# EAGLE design avoccado-avr-pcb-yolandi (EAGLE 7.2.0)
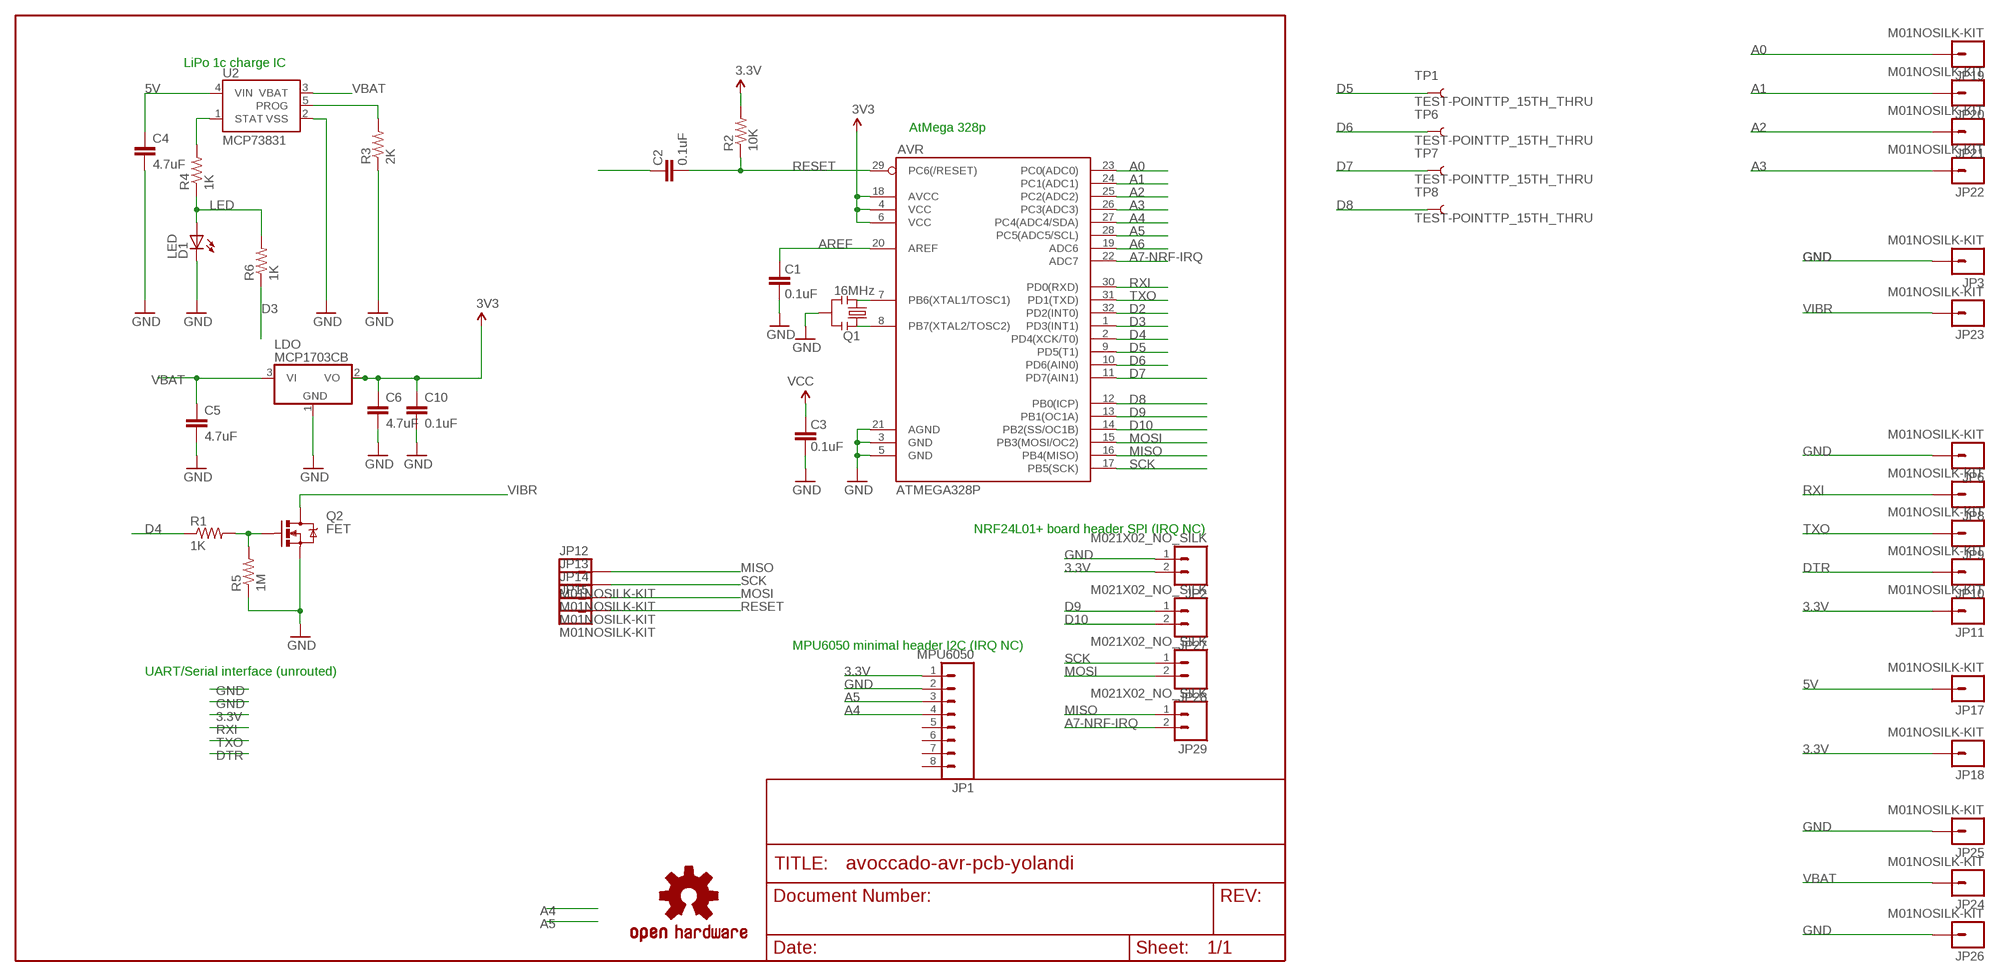
[diagram p0: schematic, sheet 1]

## Parts
AVR  ATMEGA328P  ATMEGA328_SMT  [TQFP32-08]
C1  0.1uF  CAP0402  [C0402]
C2  0.1uF  CAP0402  [C0402]
C3  0.1uF  CAP0402  [C0402]
C4  4.7uF  4.7UF-6.3V-10%(0603)0603  [0603-CAP]
C5  4.7uF  4.7UF-6.3V-10%(0603)0603  [0603-CAP]
C6  4.7uF  4.7UF-6.3V-10%(0603)0603  [0603-CAP]
C10  0.1uF  CAP0402  [C0402]
D1  LED  LED0603  [LED-0603]
JP1  MPU6050  M08NO_SILK  [1X08_PIN1_NO_SILK]
JP2  M021X02_NO_SILK  [1X02_NO_SILK]
JP3  M01NOSILK-KIT  [1X01NS-KIT]
JP6  M01NOSILK-KIT  [1X01NS-KIT]
JP8  M01NOSILK-KIT  [1X01NS-KIT]
JP9  M01NOSILK-KIT  [1X01NS-KIT]
JP10  M01NOSILK-KIT  [1X01NS-KIT]
JP11  M01NOSILK-KIT  [1X01NS-KIT]
JP12  M01NOSILK-KIT  [1X01NS-KIT]
JP13  M01NOSILK-KIT  [1X01NS-KIT]
JP14  M01NOSILK-KIT  [1X01NS-KIT]
JP15  M01NOSILK-KIT  [1X01NS-KIT]
JP17  M01NOSILK-KIT  [1X01NS-KIT]
JP18  M01NOSILK-KIT  [1X01NS-KIT]
JP19  M01NOSILK-KIT  [1X01NS-KIT]
JP20  M01NOSILK-KIT  [1X01NS-KIT]
JP21  M01NOSILK-KIT  [1X01NS-KIT]
JP22  M01NOSILK-KIT  [1X01NS-KIT]
JP23  M01NOSILK-KIT  [1X01NS-KIT]
JP24  M01NOSILK-KIT  [1X01NS-KIT]
JP25  M01NOSILK-KIT  [1X01NS-KIT]
JP26  M01NOSILK-KIT  [1X01NS-KIT]
JP27  M021X02_NO_SILK  [1X02_NO_SILK]
JP28  M021X02_NO_SILK  [1X02_NO_SILK]
JP29  M021X02_NO_SILK  [1X02_NO_SILK]
LDO  MCP1703CB  [SOT23]
LOGO1  OSHW-LOGOS  [OSHW-LOGO-S]
Q1  16MHz  RESONATORSMD  [RESONATOR-SMD]
Q2  FET  MOSFET-NCHANNEL2N7002PW  [SOT323]
R1  1K  RESISTOR0603  [0603-RES]
R2  10K  RESISTOR0603  [0603-RES]
R3  2K  RESISTOR0603  [0603-RES]
R4  1K  RESISTOR0603  [0603-RES]
R5  1M  RESISTOR0603  [0603-RES]
R6  1K  RESISTOR0603  [0603-RES]
TP1  TEST-POINTTP_15TH_THRU  [TP_15TH]
TP6  TEST-POINTTP_15TH_THRU  [TP_15TH]
TP7  TEST-POINTTP_15TH_THRU  [TP_15TH]
TP8  TEST-POINTTP_15TH_THRU  [TP_15TH]
U2  MCP73831  [SOT23-5]

## Nets
3.3V: AVR.4(VCC) AVR.6(VCC) AVR.18(AVCC) C3.2 C6.1 C10.1 JP1.1 JP2.2 JP11.1 JP18.1 LDO.2(VO) R2.2 ; supply symbol labelled VCC, 3V3
5V: C4.1 JP17.1 U2.4(VIN)
A0: AVR.23(PC0(ADC0)) JP19.1
A1: AVR.24(PC1(ADC1)) JP20.1
A2: AVR.25(PC2(ADC2)) JP21.1
A3: AVR.26(PC3(ADC3)) JP22.1
A4: AVR.27(PC4(ADC4/SDA)) JP1.4
A5: AVR.28(PC5(ADC5/SCL)) JP1.3
A6: AVR.19(ADC6)
A7-NRF-IRQ: AVR.22(ADC7) JP29.2
AREF: AVR.20(AREF) C1.2
CHG-PROG: R3.2 U2.5(PROG)
D2: AVR.32(PD2(INT0))
D3: AVR.1(PD3(INT1)) R6.1
D4: AVR.2(PD4(XCK/T0)) R1.1
D5: AVR.9(PD5(T1)) TP1.P$1
D6: AVR.10(PD6(AIN0)) TP6.P$1
D7: AVR.11(PD7(AIN1)) TP7.P$1
D8: AVR.12(PB0(ICP)) TP8.P$1
D9: AVR.13(PB1(OC1A)) JP27.1
D10: AVR.14(PB2(SS/OC1B)) JP27.2
DTR: C2.2 JP10.1
GND [vcc]: AVR.3(GND) AVR.5(GND) AVR.21(AGND) C1.1 C3.1 C4.2 C5.2 C6.2 C10.2 D1.C JP1.2 JP2.1 JP3.1 JP6.1 JP25.1 JP26.1 LDO.1(GND) Q1.2 Q2.2(S) R3.1 R5.1 U2.2(VSS)
LED: D1.A R4.1 R6.2
MISO: AVR.16(PB4(MISO)) JP12.1 JP29.1
MOSI: AVR.15(PB3(MOSI/OC2)) JP14.1 JP28.2
N$1: AVR.8(PB7(XTAL2/TOSC2)) Q1.1
N$2: AVR.7(PB6(XTAL1/TOSC1)) Q1.3
N$6: Q2.1(G) R1.2 R5.2
RESET: AVR.29(PC6(/RESET)) C2.1 JP15.1 R2.1
RXI: AVR.30(PD0(RXD)) JP8.1
SCK: AVR.17(PB5(SCK)) JP13.1 JP28.1
SOC: R4.2 U2.1(STAT)
TXO: AVR.31(PD1(TXD)) JP9.1
VBAT [vcc]: C5.1 JP24.1 LDO.3(VI) U2.3(VBAT)
VIBR: JP23.1 Q2.3(D)
Unconnected: JP1.5 JP1.6 JP1.7 JP1.8

## Notes on the sheet
- LiPo 1c charge IC
- AtMega 328p
- NRF24L01+ board header SPI (IRQ NC)
- MPU6050 minimal header I2C (IRQ NC)
- UART/Serial interface (unrouted)

## Library data of the parts
AVR = SparkFun-DigitalIC:ATMEGA328_SMT: 32-Pin Atmega328 part Commonly used on Arduino compatible boards Available in QFP and QFN packages TQFP is IC-09069 QFN is non-stock; PROD_ID: IC-09069
C1-C3 C10 = SparkFun:CAP: Capacitor Standard 0603 ceramic capacitor, and 0.1" leaded capacitor.
C4-C6 = SparkFun-Capacitors:4.7UF-6.3V-10%(0603): CAP-08280; PROD_ID: CAP-08280
D1 = SparkFun:LED: LEDs Standard schematic elements and footprints for 5mm, 3mm, 1206, and 0603 sized LEDs. 5mm - Spark Fun Electronics SKU : COM-00529 (and others)
JP1 = SparkFun-Connectors:M08: Header 8 Standard 8-pin 0.1" header. Use with straight break away headers (SKU : PRT-00116), right angle break away headers (PRT-00553), swiss pins (PRT-00743), machine pins (PRT-00117), and female headers (PRT-00115).
JP2 JP27-JP29 = SparkFun-Connectors:M02: Standard 2-pin 0.1" header. Use with - straight break away headers ( PRT-00116) - right angle break away headers (PRT-00553) - swiss pins (PRT-00743) - machine pins (PRT-00117) - female headers (PRT-00115) Molex polarized connector foot print use with: PRT-08233 with associated crimp pins and housings. 2.54_SCREWTERM for use with PRT-10571. 3.5mm Screw Terminal footprints for PRT-08084 5mm Screw Terminal footprints for use with PRT-08432
JP3 JP6 JP8-JP15 JP17-JP26 = SparkFun-Connectors:M01: Header 1 Standard 1-pin 0.1" header. Use with straight break away headers (SKU : PRT-00116), right angle break away headers (PRT-00553), swiss pins (PRT-00743), machine pins (PRT-00117), and female headers (PRT-00115).
LDO = linear:MCP1703: 250 mA, 16V, Low Quiescent Current LDO Regulator Source: http://ww1.microchip.com/downloads/en/DeviceDoc/22049b.pdf
LOGO1 = SparkFun-Aesthetics:OSHW-LOGO: Open Source Hardware Logo This logo indicates the piece of hardware it is found on incorporates a OSHW license and/or adheres to the definition of open source hardware found here: http://freedomdefined.org/OSHW
Q1 = SparkFun:RESONATOR: Resonator Small SMD resonator. This is the itty bitty 10/20MHz resonators with built in caps. CSTCE10M0G55 and CSTCE20M0V53. Footprint has been reviewed closely but hasn't been tested yet.
Q2 = SparkFun-DiscreteSemi:MOSFET-NCHANNEL: Common NMOSFET Parts MFG P/N Store ID Prod ID FDD8780 TRANS-09984 SI7820DN TRANS-11055 FDS6630A IC-08089 2N7002PW TRANS-11151 FQP30N06L COM-10213 TRANS-10060 BSS123LT1G TRANS-08345 BSS138 TRANS-00830 BS170 2N7000; PROD_ID: TRANS-11151
R1-R6 = SparkFun-Resistors:RESISTOR: Resistor Basic schematic elements and footprints for 0603, 1206, and PTH resistors.
TP1 TP6-TP8 = SparkFun-Passives:TEST-POINT: Bare copper test points for troubleshooting or ICT
U2 = SparkFun:MCP73831: Microchip's MCP73831 Miniature single cell, fully integrated Li-Ion, Li-polymer charge management controller http://ww1.microchip.com/downloads/en/DeviceDoc/21984a.pdf

## Net classes
1 vcc: width 0.254 mm
3 usbvcc: width 0.203 mm, drill 0.61 mm, clearance 0.152 mm

## Board
Avoccado-avr-yolandi Yolandi is the minified version of Avoccado-avr with less pins broken out and a footprint of less than one square inch for the PCB without peripherals.
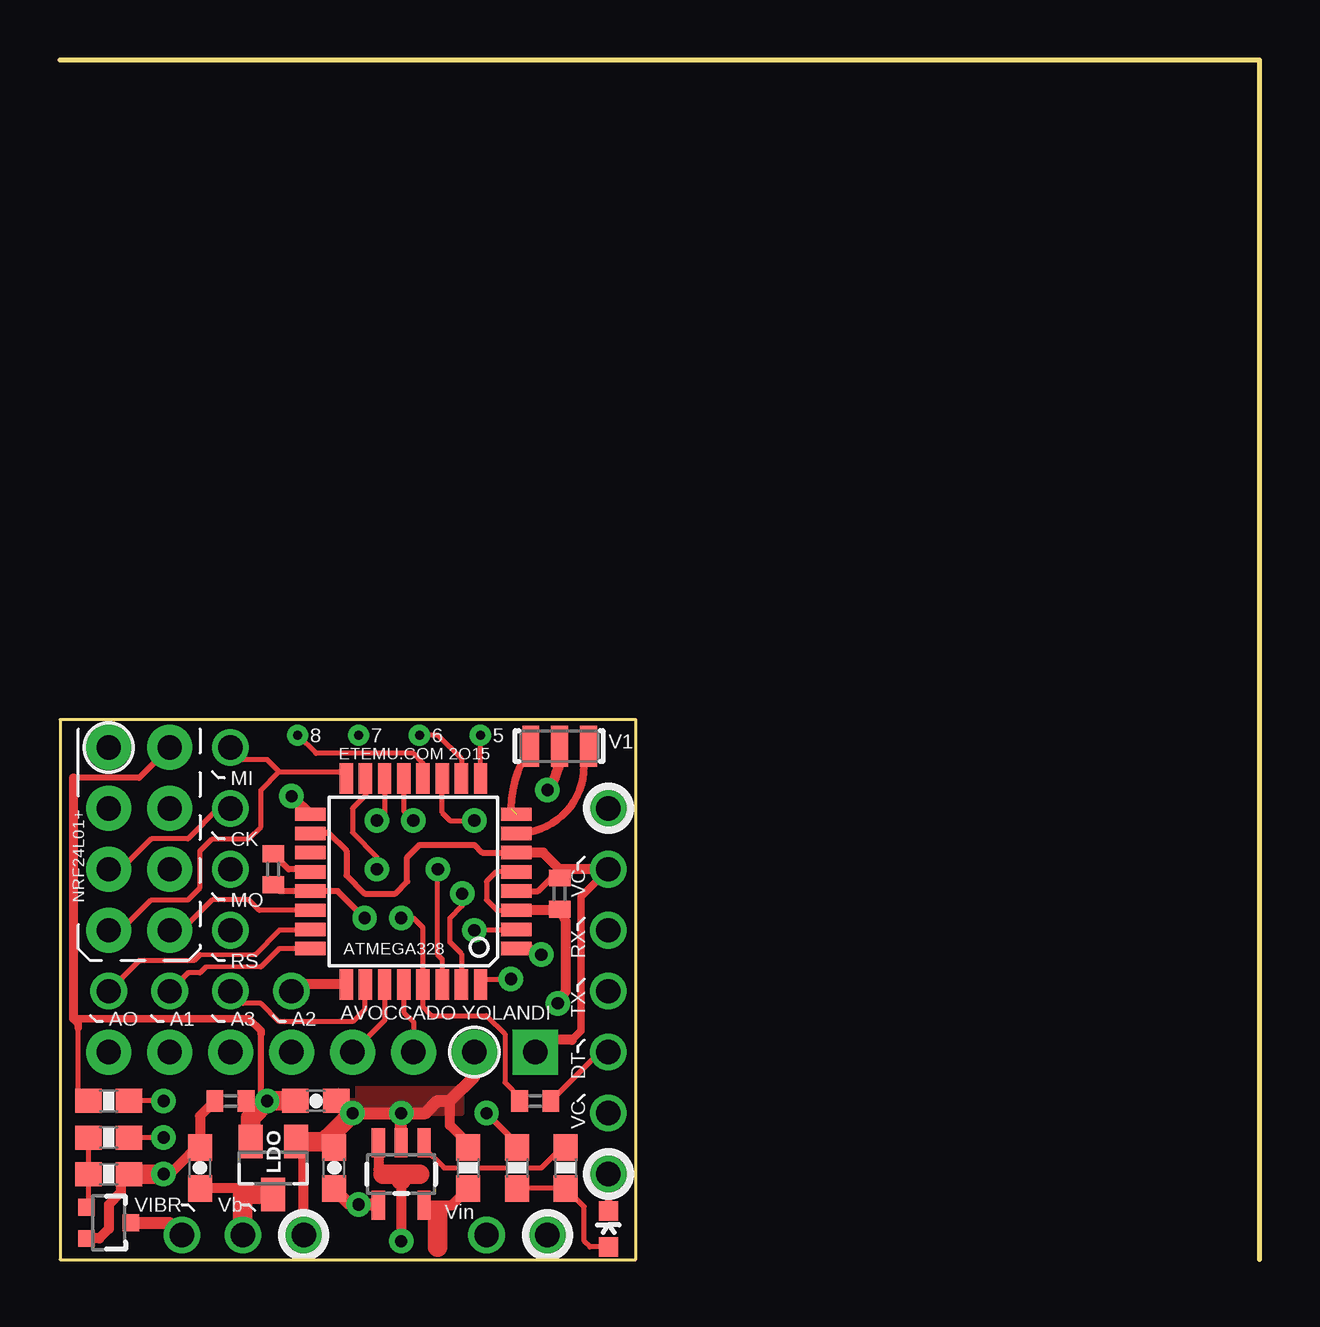
[diagram p1: board, top side]
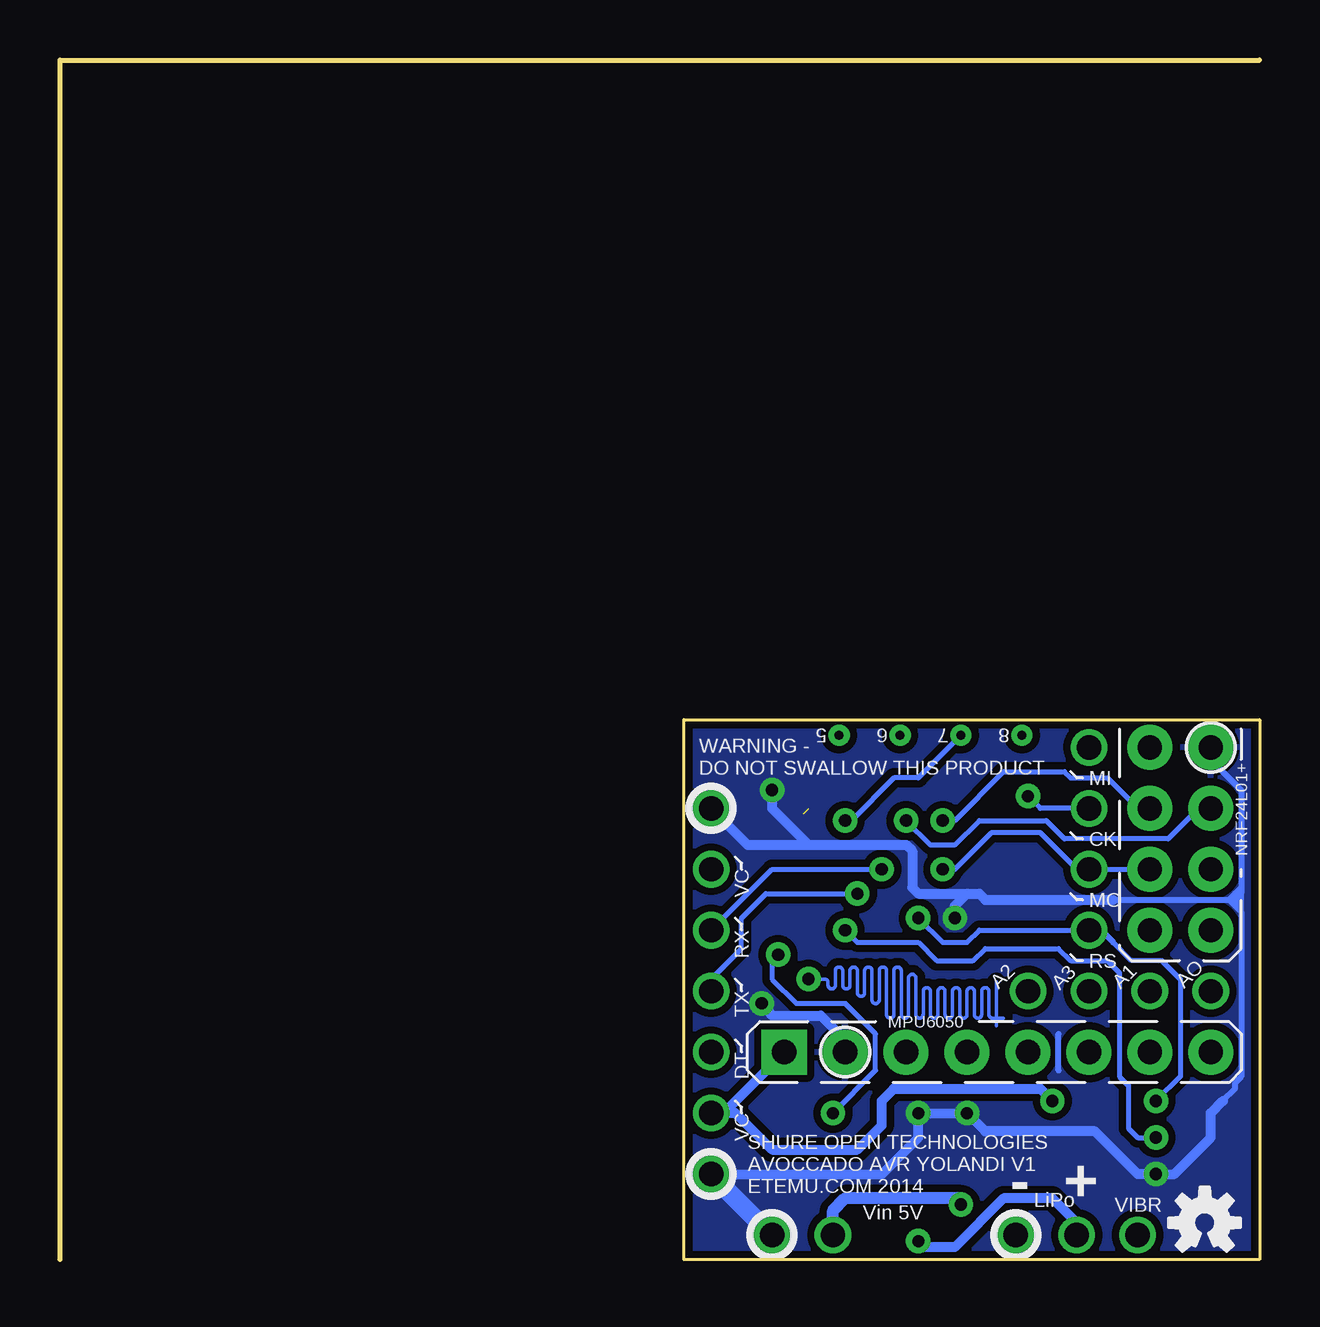
[diagram p2: board, bottom side, seen from below]

Size 50 x 49.98 mm. Coordinates in mm from the lower left corner, seen from the top.
Outline: 50,0 50,49.98 0,49.98
Outline: 0,0 24,0 24,22.5 0,22.5 0,0
Copper layers (1*16): Top 0.035mm / dielectric 1.5mm / Bottom 0.035mm
Design rules "dirt_cheap_dirty_boards.v1 *": minimum track width 5mil, minimum drill 12mil, track to track 5mil, track to pad 5mil, pad to pad 5mil, via to via 5mil, smd to smd 0mil, copper to edge 10mil, drill to drill 10mil, minimum pad ring 10mil, minimum via ring 6mil, stop-mask expansion 0mil, vias tented up to drill 25mil, thermal gap 10mil

### Footprints (pad centres in the part's own frame; a part is rotated, then mirrored left to right if it is on the bottom)
TQFP32-08 = smd 1.27 x 0.559: 1 -4.293,2.8; 2 -4.293,2; 3 -4.293,1.2; 4 -4.293,0.4; 5 -4.293,-0.4; 6 -4.293,-1.2; 7 -4.293,-2; 8 -4.293,-2.8; 17 4.293,-2.8; 18 4.293,-2; 19 4.293,-1.2; 20 4.293,-0.4; 21 4.293,0.4; 22 4.293,1.2; 23 4.293,2; 24 4.293,2.8 | smd 0.559 x 1.27: 9 -2.8,-4.293; 10 -2,-4.293; 11 -1.2,-4.293; 12 -0.4,-4.293; 13 0.4,-4.293; 14 1.2,-4.293; 15 2,-4.293; 16 2.8,-4.293; 25 2.8,4.293; 26 2,4.293; 27 1.2,4.293; 28 0.4,4.293; 29 -0.4,4.293; 30 -1.2,4.293; 31 -2,4.293; 32 -2.8,4.293
C0402 = smd 0.7 x 0.9: 1 -0.65,0; 2 0.65,0
0603-CAP = smd 1.1 x 1: 1 -0.85,0; 2 0.85,0
LED-0603 = smd 0.8 x 0.8: A 0,-0.75; C 0,0.75
1X08_PIN1_NO_SILK = drill 1.016 pad 1.88 square: 1 0,0 | drill 1.016 pad 1.88: 2 2.54,0; 3 5.08,0; 4 7.62,0; 5 10.16,0; 6 12.7,0; 7 15.24,0; 8 17.78,0
1X02_NO_SILK = drill 1.016 pad 1.88: 1 0,0; 2 2.54,0
1X01NS-KIT = drill 1.016 pad 1.524: 1 0,0
SOT23 = smd 1 x 1.4: 1 -0.95,-1.1; 2 0.95,-1.1; 3 0,1.1
RESONATOR-SMD = smd 0.7 x 1.7: 1 -1.2,0; 2 0,0; 3 1.2,0
SOT323 = smd 0.7 x 0.7: 1 -0.65,-0.925; 2 0.65,-0.925; 3 0,0.925
0603-RES = smd 1.1 x 1: 1 -0.85,0; 2 0.85,0
TP_15TH = drill 0.381 pad 0.61: P$1 0,0
SOT23-5 = smd 0.55 x 1.2: 1 -0.95,-1.3; 2 0,-1.3; 3 0.95,-1.3; 4 0.95,1.3; 5 -0.95,1.3

### Placement (x,y rotation side)
AVR  14.73,15.76 180 top
C1  8.89,16.26 90 top
C2  19.81,6.61 0 top
C3  20.83,15.25 90 top
C4  11.43,3.82 90 top
C5  5.84,3.82 90 top
C6  10.67,6.61 0 top
C10  7.11,6.61 180 top
D1  22.86,1.28 0 top
JP1  19.81,8.64 180 top
JP2  2.03,21.34 0 top
JP3  22.86,18.8 0 top
JP6  22.86,3.56 0 top
JP8  22.86,13.72 0 top
JP9  22.86,11.18 0 top
JP10  22.86,8.64 0 top
JP11  22.86,16.26 0 top
JP12  7.11,21.34 0 top
JP13  7.11,18.8 0 top
JP14  7.11,16.26 0 top
JP15  7.11,13.72 0 top
JP17  17.78,1.02 0 top
JP18  22.86,6.1 0 top
JP19  2.03,11.18 90 top
JP20  4.57,11.18 90 top
JP21  9.65,11.18 90 top
JP22  7.11,11.18 90 top
JP23  5.08,1.02 0 top
JP24  7.62,1.02 0 top
JP25  10.16,1.02 0 top
JP26  20.32,1.02 0 top
JP27  2.03,18.8 0 top
JP28  2.03,16.26 0 top
JP29  2.03,13.72 0 top
LDO  8.89,3.82 180 top
LOGO1  2.29,1.53 0 bottom
Q1  20.83,21.39 0 top
Q2  2.03,1.53 270 top
R1  2.03,5.09 180 top
R2  2.03,6.61 180 top
R3  Rchg  [0603-RES]  17.02,3.82 270 top
R4  21.08,3.82 90 top
R5  2.03,3.56 180 top
R6  19.05,3.82 270 top
TP1  17.53,21.85 270 top
TP6  14.99,21.85 270 top
TP7  12.45,21.85 270 top
TP8  9.91,21.85 270 top
U2  14.22,3.56 180 top

### Tracks (layer width: path | path; a pad name or v marks a point on that pad's centre or on a via)
3.3V  (via drill 0.51 pad 1.02)
  Top 0.203: AVR.18 10.47,17.79 | 0.76,9.66 0.76,7.03 R2.2 | C10.1 v8.64,6.61
  Top 0.254: 10.47,17.79 11.18,17.79 11.94,17.03 11.94,16.01 12.7,15.25 13.97,15.25 14.48,15.76 14.48,16.77 14.99,17.28 17.27,17.28 17.6,16.96 AVR.6 | 20.83,16.26 C3.2 20.46,15.9 19.92,15.36 AVR.4 | 10.41,17.79 AVR.18 | JP2.2 3.3,20.07 0.56,20.07 | v8.64,6.61 8.38,6.87 8.38,9.41
  Top 0.305: 8.38,9.41 8.38,9.53 7.87,10.04 0.56,10.04 0.76,9.84 0.76,9.66 | JP11.1 21.72,15.12 21.72,9.53 21.34,9.15 | 20.32,9.15 JP1.1
  Top 0.381: 0.56,20.07 0.56,10.04
  Top 0.406: JP11.1 20.83,16.26 20.14,16.96 AVR.6 | C10.1 7.69,6.54 | 21.34,9.15 20.32,9.15
  Top 0.813: LDO.2 7.94,5.92 v8.64,6.61 C6.1
  Bottom 0.406: JP1.1 22.35,6.1 JP18.1 21.84,6.1 20.32,4.58 16.76,4.58 15.75,5.6 15.75,6.61 15.24,7.12 9.14,7.12 v8.64,6.61
5V  (via drill 0.51 pad 1.02)
  Top 0.508: U2.4 13.24,2.29 v12.45,2.29 12.1,2.29 C4.1
  Bottom 0.508: v12.45,2.29 12.45,2.55 17.27,2.55 17.78,2.04 JP17.1
A0
  Top 0.178: 8.13,12.71 5.84,12.71
  Top 0.203: AVR.23 10.41,13.72 9.14,13.72 8.13,12.71 | 5.84,12.71 5.59,12.45 3.3,12.45 JP19.1
A1
  Top 0.178: 8.38,12.2 6.1,12.2
  Top 0.203: AVR.24 9.14,12.96 8.38,12.2 | 6.1,12.2 5.84,11.95 5.33,11.95 JP20.1
A2
  Top 0.406: AVR.25 9.93,11.46 JP21.1
A3
  Top 0.203: AVR.26 12.7,11.43 12.7,10.42 12.19,9.91 9.14,9.91 8.38,10.68 7.62,10.68 JP22.1
A4
  Top 0.203: AVR.27 13.53,9.98 JP1.4
A5
  Top 0.203: AVR.28 14.33,10.31 14.73,9.91 JP1.3
A7-NRF-IRQ
  Top 0.203: AVR.22 8.31,14.56 7.87,14.99 6.35,14.99 5.08,13.72 JP29.2
AREF
  Top 0.203: 10.33,16.26 AVR.20 | 9,16.91 C1.2
  Top 0.254: 10.33,16.26 9.54,16.26 C1.2
CHG-PROG
  Top 0.406: R3.2 16.31,2.26 U2.5 15.52,2.26 15.75,2.04
  Top 0.813: 15.75,2.04 15.75,0.52
D2  (via drill 0.51 pad 1.02)
  Top 0.203: AVR.32 17.76,11.69 v18.8,11.69
  Bottom 0.152: v18.8,11.69 18.14,11.69 arc90 17.98,11.54 17.98,11.43 arc-90 17.83,11.28 arc-90 17.68,11.43 17.68,12.04 arc90 17.53,12.19 arc90 17.37,12.04 17.37,11.43 arc-90 17.22,11.28 arc-90 17.07,11.43 17.07,12.04 arc90 16.92,12.19 arc90 16.76,12.04 16.76,11.12 arc-90 16.61,10.97 arc-90 16.46,11.12 16.46,12.04 arc90 16.31,12.19 arc90 16.15,12.04 16.15,10.82 arc-90 16,10.67 arc-90 15.85,10.82 15.85,12.04 arc90 15.7,12.19 arc90 15.54,12.04 15.54,10.21 arc-90 15.39,10.06 arc-90 15.24,10.21 15.24,12.04 arc90 15.09,12.19 arc90 14.94,12.04 14.94,10.21 arc-90 14.78,10.06 arc-90 14.63,10.21 14.63,11.73 arc90 14.48,11.89 arc90 14.33,11.73 14.33,10.21 arc-90 14.17,10.06 arc-90 14.02,10.21 14.02,11.18 arc90 13.87,11.33 arc90 13.72,11.18 13.72,10.21 arc-90 13.56,10.06 arc-90 13.41,10.21 13.41,11.18 arc90 13.26,11.33 arc90 13.11,11.18 13.11,10.21 arc-90 12.95,10.06 arc-90 12.8,10.21 12.8,11.18 arc90 12.65,11.33 arc90 12.5,11.18 12.5,10.21 arc-90 12.34,10.06 arc-90 12.19,10.21 12.19,11.18 arc90 12.04,11.33 arc90 11.89,11.18 11.89,10.21 arc-90 11.73,10.06 arc-90 11.58,10.21 11.58,11.18 arc90 11.43,11.33 arc90 11.28,11.18 11.28,10.21 arc-90 11.12,10.06 10.97,10.06 | 10.97,10.06 10.97,11.58 | 10.97,10.06 10.97,9.75 | 10.97,10.06 10.67,10.06
D3  (via drill 0.51 pad 1.02)
  Top 0.203: 18.54,12.96 AVR.1 19.56,12.96
  Top 0.254: v17.78,6.1 19.05,4.83 R6.1
  Top 0.406: 19.56,12.96 19.81,12.71 v20.07,12.71
  Bottom 0.203: v17.78,6.1 16,7.88 16,9.41 17.27,10.68 19.3,10.68 20.32,11.69 20.32,12.45 v20.07,12.71
D4  (via drill 0.51 pad 1.02)
  Top 0.203: AVR.2 18.99,13.72 v17.27,13.72 | v4.32,5.09 R1.1
  Bottom 0.203: v4.32,5.09 5.08,5.09 5.46,5.47 5.46,7.25 5.84,7.63 5.84,11.95 6.35,12.45 7.87,12.45 8.38,12.96 11.43,12.96 11.94,12.45 13.46,12.45 14.22,13.22 16.76,13.22 v17.27,13.72
D5
  Top 0.203: AVR.9 TP1.P$1
D6
  Top 0.203: AVR.10 16.73,20.87 15.75,21.85 TP6.P$1
D7  (via drill 0.51 pad 1.02)
  Top 0.203: AVR.11 15.93,18.62 16.26,18.3 v17.27,18.3
  Bottom 0.203: v17.27,18.3 17.02,18.3 15.24,20.07 14.22,20.07 TP7.P$1
D8
  Top 0.203: AVR.12 15.13,20.69 14.73,21.09 10.67,21.09 TP8.P$1
D9  (via drill 0.51 pad 1.02)
  Top 0.203: AVR.13 14.33,18.7 v14.73,18.3
  Bottom 0.203: JP27.1 2.54,18.8 3.81,17.53 8.13,17.53 8.89,18.3 11.68,18.3 12.7,17.28 13.72,17.28 v14.73,18.3
D10  (via drill 0.51 pad 1.02)
  Top 0.203: AVR.14 13.53,18.62 v13.21,18.3
  Bottom 0.203: v13.21,18.3 12.7,18.3 10.67,20.33 8.13,20.33 7.87,20.07 6.35,20.07 5.08,18.8 JP27.2
DTR
  Top 0.203: C2.2 22.49,8.64 JP10.1
GND  (via drill 0.51 pad 1.02)
  Top 0.203: AVR.5 18.18,16.16 17.78,15.76 17.78,14.99 18.22,14.56 AVR.3 | R3.1 16.93,4.67
  Top 0.254: v12.7,14.23 11.58,15.36 AVR.21 9.15,15.36 C1.1
  Top 0.305: D1.C JP6.1
  Top 0.406: AVR.3 20.79,14.56 C3.1 21.08,14.09 21.08,11.18 v20.75,10.68 | 9.79,4.96 LDO.1 10.16,4.34 JP25.1 | C10.2 5.84,5.99 C5.2 5.42,4.41 4.57,3.56 v4.32,3.56 | C6.2 11.43,6.52 | R5.1 2.54,3.22 2.54,2.8 2.03,2.29 2.03,1.28 1.64,0.88 Q2.2 | 11.18,4.92 C4.2 | 16.93,4.67 16.93,4.92 16.26,5.6 16.26,6.61 | Q1.2 20.83,21.09 arc-37 v20.32,19.57
  Top 0.508: v14.22,6.1 v12.19,6.1 11.68,6.61 C6.2 | v14.22,6.1 15.24,6.1 15.75,6.61 16.26,6.61 17.27,7.63 JP1.2 | U2.2 v14.22,6.1
  Top 0.813: R5.1 v4.32,3.56 | LDO.1 11.01,4.92 11.18,5.09 | 11.18,5.09 v12.19,6.1 | 11.18,4.92 11.18,5.08 11.18,5.09
  Bottom 0.254: JP2.1 2.03,20.84 0.76,19.57 0.76,15.5 | 0.76,14.49 0.76,7.63 1.02,7.37 1.02,7.12 1.52,6.61 | 6.1,14.99 1.27,14.99 | 1.27,14.99 1.02,15.25 | 1.02,15.25 0.76,15.5 | 1.27,14.99 1.02,14.74 | 1.02,14.74 0.76,14.49 | 0.76,15.5 0.76,15.25 | 0.76,15.25 1.02,14.99 1.02,14.74 | 0.76,14.49 0.76,15.25 | 0.76,15.25 1.02,15.25 | 8.38,7.88 8.38,9.41
  Bottom 0.406: JP1.2 17.27,9.15 18.29,10.17 20.32,10.17 v20.75,10.68 | 22.85,3.56 15.75,3.56 14.22,5.09 v14.22,6.1 v12.19,6.1 11.43,5.34 6.86,5.34 5.08,3.56 v4.32,3.56 3.56,3.56 2.03,5.09 2.03,6.1 1.52,6.61 | JP3.1 21.34,17.28 18.8,17.28 | 18.8,17.28 14.73,17.28 14.48,17.03 14.48,15.5 14.22,15.25 12.19,15.25 | 12.19,15.25 11.68,15.25 11.43,14.99 6.1,14.99 | v12.7,14.23 12.7,14.74 12.19,15.25 | v20.32,19.57 20.32,18.8 18.8,17.28
  Bottom 0.813: JP26.1 JP6.1
  pour Bottom (isolate 0.305): 0,22.46 23.99,22.46 23.99,0 0,0
  pour Top (isolate 0.305): 11.68,6.1 16.76,6.1 16.76,7.12 11.68,7.12
LED
  Top 0.203: R6.2 R4.1 21.84,2.21 21.84,0.77 22.09,0.53 D1.A
MISO
  Top 0.203: 11.94,19.57 AVR.16 11.65,20.33 9.14,20.33 | JP29.1 2.54,13.72 3.81,14.99 5.33,14.99 5.84,15.5 5.84,17.03 6.35,17.53 7.87,17.53 8.38,18.04 8.38,19.57 9.14,20.33 | 9.14,20.33 8.64,20.84 7.62,20.84 JP12.1
MOSI  (via drill 0.51 pad 1.02)
  Top 0.203: AVR.15 12.73,19.34 12.19,18.8 12.19,17.79 13.21,16.77 v13.21,16.26
  Bottom 0.203: v13.21,16.26 12.7,16.26 11.18,17.79 9.14,17.79 7.62,16.26 JP14.1 JP28.2 4.83,16.26
N$1  (1 unrouted)
  Top 0.254: 18.8,18.79 18.8,18.8
  Top 0.305: 18.8,18.8 arc-33 Q1.1
N$2
  Top 0.254: 21.84,20.84 arc90 22.03,21.02 Q1.3
  Top 0.305: AVR.7 arc90 21.84,20.57 21.84,20.84
N$6
  Top 0.203: R1.2 R5.2 1.18,2.26 Q2.1
RESET  (via drill 0.51 pad 1.02)
  Top 0.203: C2.1 19.16,6.75 18.54,7.37 18.54,9.41 17.78,10.17 15.49,10.17 15.13,10.53 AVR.29 15.13,13.83 14.73,14.23 v14.22,14.23 | v4.32,6.61 R2.1
  Bottom 0.203: v14.22,14.23 13.21,13.22 12.19,13.22 11.68,13.72 JP15.1 | v4.32,6.61 3.3,7.63 3.3,11.69 4.06,12.45 5.33,12.45 6.1,13.22
  Bottom 0.254: 6.1,13.22 6.6,13.72 JP15.1
RXI  (via drill 0.51 pad 1.02)
  Top 0.203: AVR.30 15.93,12.52 15.75,12.71 v15.75,16.26
  Bottom 0.203: JP8.1 20.32,16.26 v15.75,16.26
SCK  (via drill 0.51 pad 1.02)
  Top 0.203: JP28.1 2.54,16.26 3.81,17.53 5.33,17.53 6.6,18.8 JP13.1
  Top 0.406: v9.65,19.31 9.68,19.31 AVR.17
  Bottom 0.203: JP13.1 9.14,18.8 v9.65,19.31
SOC
  Top 0.203: U2.1 15.17,4.65 16,3.82 20.07,3.82 20.92,4.67 R4.2
TXO  (via drill 0.51 pad 1.02)
  Top 0.203: AVR.31 16.73,12.74 16.26,13.22 16.26,14.23 16.76,14.74 v16.76,15.25
  Bottom 0.203: JP9.1 22.86,11.69 21.59,12.96 21.59,14.23 20.57,15.25 v16.76,15.25
VBAT  (via drill 0.51 pad 1.02)
  Top 0.406: U2.3 13.27,3.75 13.46,3.56 | 14.22,3.31 v14.22,0.77 | 7.62,2.72 7.37,2.97 C5.1
  Top 0.813: 14.22,3.31 14.22,3.56 | 14.22,3.56 14.99,3.56 | 14.22,3.56 13.46,3.56 | LDO.3 7.62,2.72 JP24.1
  Bottom 0.406: JP24.1 7.62,1.53 8.64,2.55 10.67,2.55 12.7,0.52 13.97,0.52 v14.22,0.77
VIBR
  Top 0.508: Q2.3 4.57,1.53 JP23.1

### Text on the board
tPlace: 8 | 7 | 6 | 5 | V1 | ETEMU.COM 2O15 | MI | CK | VC | NRF24L01+ | MO | RX | ATMEGA328 | RS | TX | AO | A1 | A3 | A2 | AVOCCADO YOLANDI | DT | VC | VIBR | Vb | Vin
bPlace: 8 | 7 | 6 | 5 | WARNING - / DO NOT SWALLOW THIS PRODUCT | NRF24L01+ | MI | CK | VC | MO | RX | RS | AO | A1 | A3 | A2 | TX | MPU6050 | DT | VC | SHURE OPEN TECHNOLOGIES / AVOCCADO AVR YOLANDI V1 / ETEMU.COM 2014 | + | - | VIBR | LiPo | Vin 5V